# Altium schematic sheet Atmega.SchDoc
size A4
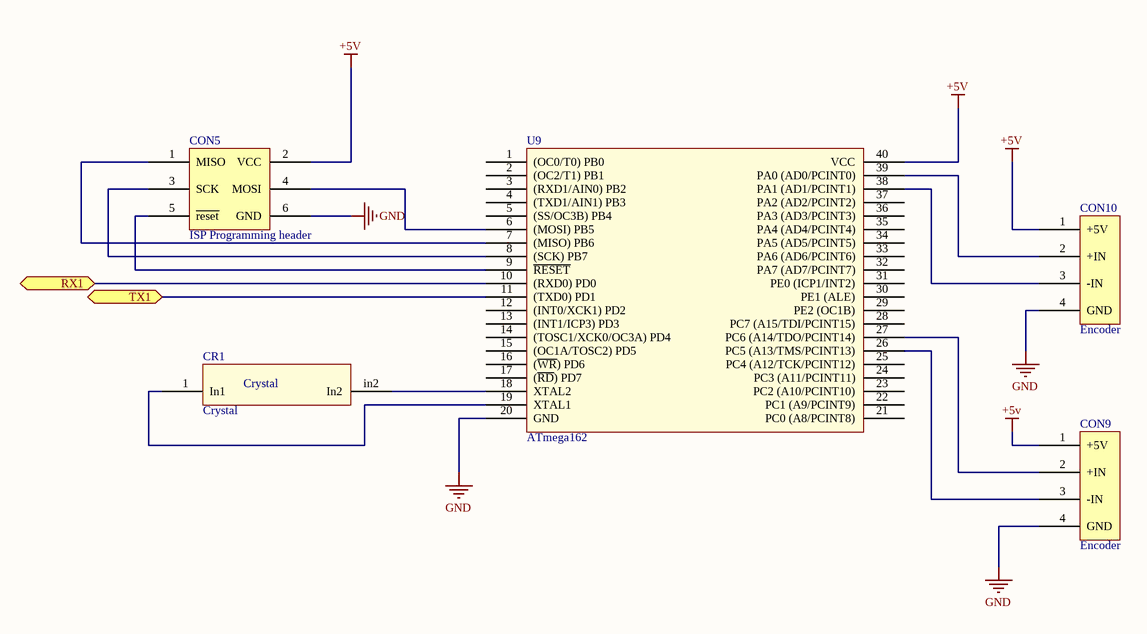
[diagram p0: Atmega.SchDoc]

## Parts
CON5  ISP Programming header  [ISP programming header]
CON9  Encoder
CON10  Encoder
CR1  Crystal  [Crystal]
U9  ATmega162  [ATmega162]

## Ports
RX1, TX1

## Nets
+5V: CON5.2(VCC) CON9.1(+5V) CON10.1(+5V) U9.40(VCC)
GND: CON5.6(GND) CON9.4(GND) CON10.4(GND) U9.20(GND)
RX1: U9.10((RXD0)_PD0) ; port RX1
TX1: U9.11((TXD0)_PD1) ; port TX1
NetCON5_1: CON5.1(MISO) U9.7((MISO)_PB6)
NetCON5_3: CON5.3(SCK) U9.8((SCK)_PB7)
NetCON5_4: CON5.4(MOSI) U9.6((MOSI)_PB5)
NetCON5_5: CON5.5(~{reset}) U9.9(~{RESET})
NetCON9_2: CON9.2(+IN) U9.27(PC6_(A14/TDO/PCINT14))
NetCON9_3: CON9.3(-IN) U9.26(PC5_(A13/TMS/PCINT13))
NetCON10_2: CON10.2(+IN) U9.39(PA0_(AD0/PCINT0))
NetCON10_3: CON10.3(-IN) U9.38(PA1_(AD1/PCINT1))
NetCR1_1: CR1.1(In1) U9.19(XTAL1)
NetCR1_in2: CR1.in2(In2) U9.18(XTAL2)

Not connected (* = marked no-connect by the designer): U9 1((OC0/T0)_PB0) 2((OC2/T1)_PB1) 3((RXD1/AIN0)_PB2) 4((TXD1/AIN1)_PB3) 5((SS/OC3B)_PB4) 12((INT0/XCK1)_PD2) 13((INT1/ICP3)_PD3) 14((TOSC1/XCK0/OC3A)_PD4) 15((OC1A/TOSC2)_PD5) 16((~{WR})_PD6) 17((~{RD})_PD7) 21(PC0_(A8/PCINT8)) 22(PC1_(A9/PCINT9)) 23(PC2_(A10/PCINT10)) 24(PC3_(A11/PCINT11)) 25(PC4_(A12/TCK/PCINT12)) 28(PC7_(A15/TDI/PCINT15)) 29(PE2_(OC1B)) 30(PE1_(ALE)) 31(PE0_(ICP1/INT2)) 32(PA7_(AD7/PCINT7)) 33(PA6_(AD6/PCINT6)) 34(PA5_(AD5/PCINT5)) 35(PA4_(AD4/PCINT4)) 36(PA3_(AD3/PCINT3)) 37(PA2_(AD2/PCINT2))